# Altium schematic sheet B38_NTC.SchDoc
size A4; SheetNumber: 5; SheetTotal: 11
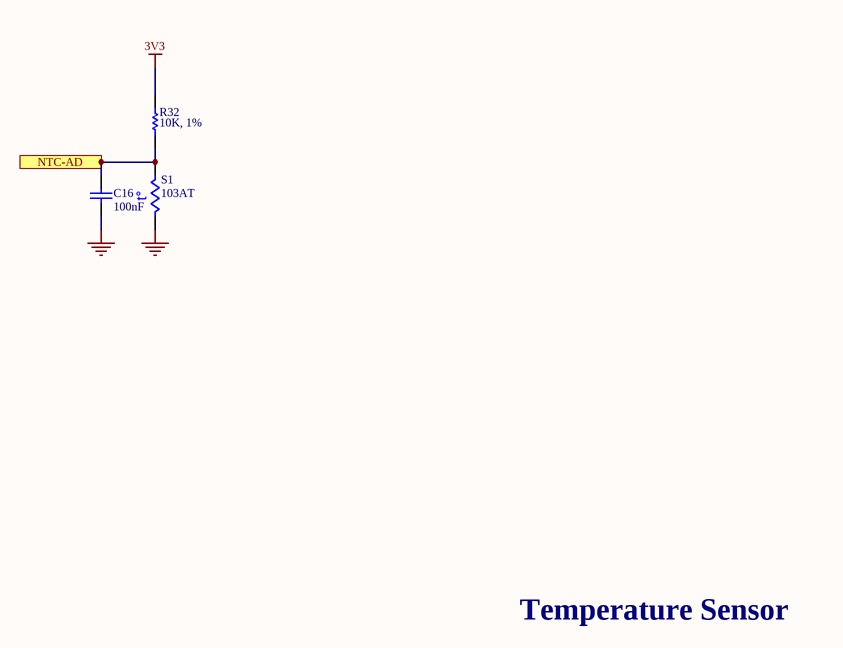
[diagram p0: B38_NTC.SchDoc]

## Parts
C16  100nF  [CAP0603]
R32  10K, 1%  [RES0603]
S1  103AT  [103AT]

## Ports
NTC-AD (out)

## Nets
3V3: R32.2
GND: C16.1 S1.2
NTC-AD: C16.2 R32.1 S1.1 ; port NTC-AD

## Notes on the sheet
- Temperature Sensor
- (in symbol Res Thermal) t°

## Library data of the parts
C16 = Cap: Capacitor 10V, 10%; Manufacturer: Walsin; PN: 0603B104K100CT; Value: 100nF
R32 = Res1: Resistor; Manufacturer: Panasonic; Value: 120Ω
S1 = Res Thermal: Thermistor